# EAGLE design trashotron-driver (EAGLE 9.6.2)
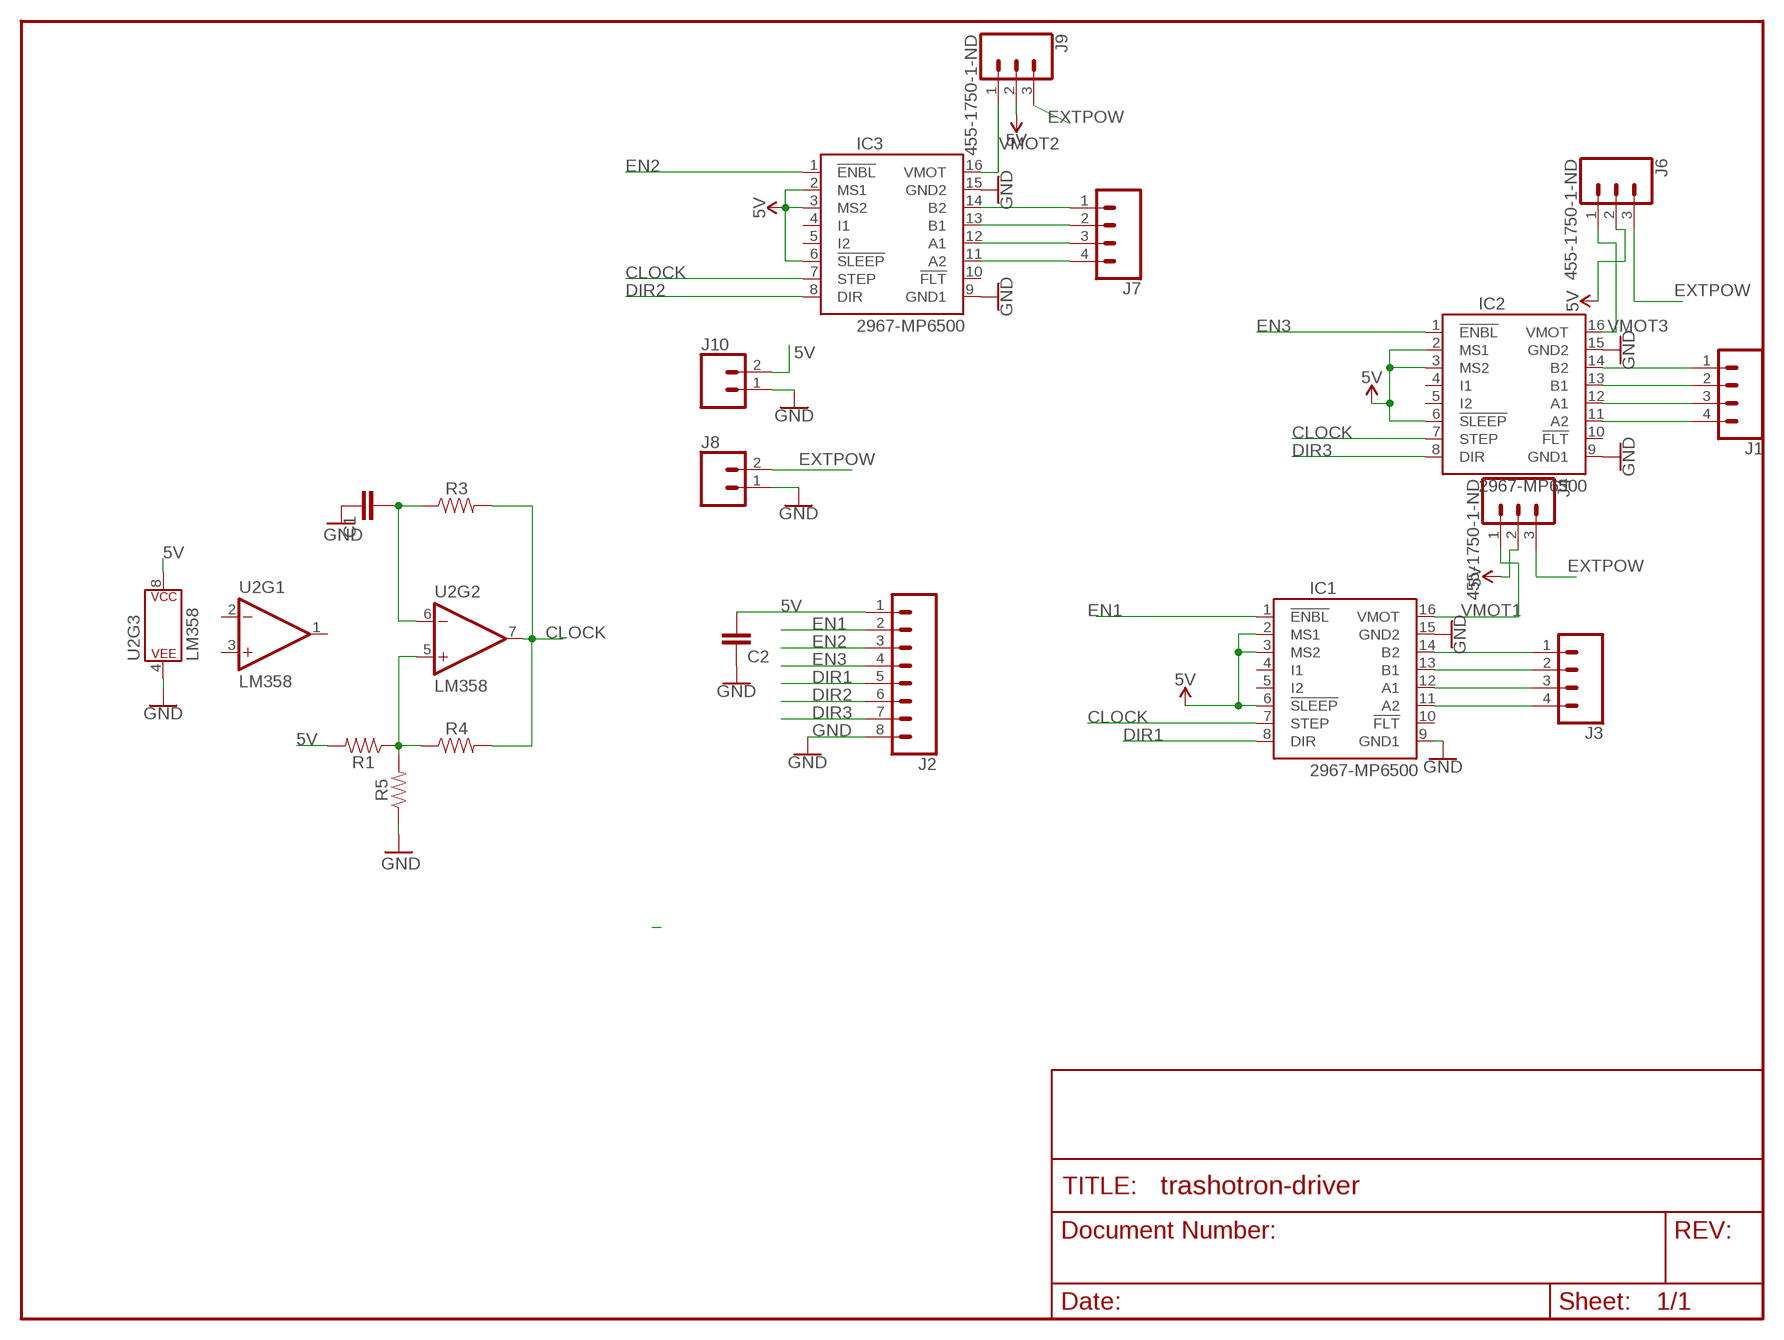
[diagram p0: schematic, sheet 1]

## Parts
C1  C-EU050-050X075  [C050-050X075]
C2  C-EU050-050X075  [C050-050X075]
IC1  2967-MP6500  [MP6500]
IC2  2967-MP6500  [MP6500]
IC3  2967-MP6500  [MP6500]
J1  CONN_04  [1X04]
J2  CONN_08"  [1X08]
J3  CONN_04  [1X04]
J4  455-1750-1-ND  CONN_03  [1X03]
J6  455-1750-1-ND  CONN_03  [1X03]
J7  CONN_04  [1X04]
J8  CONN_02  [1X02]
J9  455-1750-1-ND  CONN_03  [1X03]
J10  CONN_02  [1X02]
R1  RESISTORAXIAL-0.3  [AXIAL-0.3]
R3  RESISTORAXIAL-0.3  [AXIAL-0.3]
R4  RESISTORAXIAL-0.3  [AXIAL-0.3]
R5  RESISTORAXIAL-0.3  [AXIAL-0.3]
U2  LM358  [DIP08]

## Nets
5V: C2.2 IC1.2(MS1) IC1.3(MS2) IC1.6(!SLEEP) IC2.2(MS1) IC2.3(MS2) IC2.6(!SLEEP) IC3.2(MS1) IC3.3(MS2) IC3.6(!SLEEP) J2.1 J4.2 J6.2 J9.2 J10.2 R1.P$2 U2.8(P$V+)
CLOCK: IC1.7(STEP) IC2.7(STEP) IC3.7(STEP) R3.P$2 R4.P$2 U2.7(OUT)
DIR1: IC1.8(DIR) J2.5
DIR2: IC3.8(DIR) J2.6
DIR3: IC2.8(DIR) J2.7
EN1: IC1.1(!ENBL) J2.2
EN2: IC3.1(!ENBL) J2.3
EN3: IC2.1(!ENBL) J2.4
EXTPOW: J4.3 J6.3 J8.2 J9.3
GND [vcc]: C1.1 C2.1 IC1.9(GND1) IC1.15(GND2) IC2.9(GND1) IC2.15(GND2) IC3.9(GND1) IC3.15(GND2) J2.8 J8.1 J10.1 R5.P$1 U2.4(P$V-)
N$1: IC3.14(B2) J7.1
N$4: IC3.13(B1) J7.2
N$5: IC1.14(B2) J3.1
N$6: IC1.13(B1) J3.2
N$7: IC1.12(A1) J3.3
N$8: IC1.11(A2) J3.4
N$9: IC2.14(B2) J1.1
N$10: IC2.13(B1) J1.2
N$11: IC2.12(A1) J1.3
N$12: IC2.11(A2) J1.4
N$13: IC3.12(A1) J7.3
N$14: IC3.11(A2) J7.4
N$18: C1.2 R3.P$1 U2.6(-IN)
N$19: R1.P$1 R4.P$1 R5.P$2 U2.5(+IN)
VMOT1: IC1.16(VMOT) J4.1
VMOT2: IC3.16(VMOT) J9.1
VMOT3: IC2.16(VMOT) J6.1
Unconnected: IC1.4(I1) IC1.5(I2) IC1.10(!FLT) IC2.4(I1) IC2.5(I2) IC2.10(!FLT) IC3.4(I1) IC3.5(I2) IC3.10(!FLT) U2.1(OUT) U2.2(-IN) U2.3(+IN)

## Library data of the parts
C1 C2 = rcl:C-EU: CAPACITOR, European symbol; SPICEPREFIX: C
IC1-IC3 = pololu-stepper-driver:2967-MP6500: MP6500 Stepper Motor Driver Carrier; Potentiometer Current Control (Header Pins Soldered) #2967 MP6500 Stepper Motor Driver Carrier; Potentiometer Current Control (Header Pins Soldered) <https://www.pololu.com/product/2967> in Japan, Suzaku Lab. Ltd. <https://suzakugiken.jp/> #2967 MP6500ステッピングモータドライバボード ポテンショメータ式電流制御 (ヘッダーピン実装済み) <https://szc.jp/po2967>
J1 J3 J7 = SparkFun-Connectors:CONN_04: Multi connection point. Often used as Generic Header-pin footprint for 0.1 inch spaced/style header connections On any of the 0.1 inch spaced packages, you can populate with these: Break Away Headers - Straight <https://www.sparkfun.com/products/116> (PRT-00116) Break Away Male Headers - Right Angle <https://www.sparkfun.com/products/553> (PRT-00553) Female Headers <https://www.sparkfun.com/products/115> (PRT-00115) Break Away Headers - Machine Pin <https://www.sparkfun.com/products/117> (PRT-00117) Break Away Female Headers - Swiss Machine Pin <https://www.sparkfun.com/products/743> (PRT-00743) For SCREWTERMINALS and SPRING TERMINALS visit here: Screw Terimnals on SparkFun.com <https://www.sparkfun.com/search/results?term=Screw+Terminals> (5mm/3.5mm/2.54mm spacing) This device is also useful as a general connection point to wire up your design to another part of your project. Our various solder wires solder well into these plated through hole pads. Hook-Up Wire - Assortment (Stranded, 22 AWG) <https://www.sparkfun.com/products/11375> (PRT-11375) Hook-Up Wire - Assortment (Solid Core, 22 AWG) <https://www.sparkfun.com/products/11367> (PRT-11367) View the entire wire category on our website here <https://www.sparkfun.com/categories/141> Special notes: Molex polarized connector foot print use with SKU : PRT-08231 with associated crimp pins and housings. 1MM SMD Version SKU: PRT-10208; PROD_ID: CONN-09696
J2 = SparkFun-Connectors:CONN_08: Multi connection point. Often used as Generic Header-pin footprint for 0.1 inch spaced/style header connections On any of the 0.1 inch spaced packages, you can populate with these: Break Away Headers - Straight <https://www.sparkfun.com/products/116> (PRT-00116) Break Away Male Headers - Right Angle <https://www.sparkfun.com/products/553> (PRT-00553) Female Headers <https://www.sparkfun.com/products/115> (PRT-00115) Break Away Headers - Machine Pin <https://www.sparkfun.com/products/117> (PRT-00117) Break Away Female Headers - Swiss Machine Pin <https://www.sparkfun.com/products/743> (PRT-00743) Arduino Stackable Header - 8 Pin <https://www.sparkfun.com/products/9279> (PRT-09279) For SCREWTERMINALS and SPRING TERMINALS visit here: Screw Terimnals on SparkFun.com <https://www.sparkfun.com/search/results?term=Screw+Terminals> (5mm/3.5mm/2.54mm spacing) This device is also useful as a general connection point to wire up your design to another part of your project. Our various solder wires solder well into these plated through hole pads. Hook-Up Wire - Assortment (Stranded, 22 AWG) <https://www.sparkfun.com/products/11375> (PRT-11375) Hook-Up Wire - Assortment (Solid Core, 22 AWG) <https://www.sparkfun.com/products/11367> (PRT-11367) View the entire wire category on our website here <https://www.sparkfun.com/categories/141> Special notes: Molex polarized connector foot print use with SKU : PRT-08231 with associated crimp pins and housings. 1MM SMD Version SKU: PRT-10208 NOTES ON THE VARIANTS LOCK and LOCK_LONGPADS... This footprint was designed to help hold the alignment of a through-hole component (i.e. 6-pin header) while soldering it into place. You may notice that each hole has been shifted either up or down by 0.005 of an inch from it's more standard position (which is a perfectly straight line). This slight alteration caused the pins (the squares in the middle) to touch the edges of the holes. Because they are alternating, it causes a "brace" to hold the component in place. 0.005 has proven to be the perfect amount of "off-center" position when using our standard breakaway headers. Although looks a little odd when you look at the bare footprint, once you have a header in there, the alteration is very hard to notice. Also,if you push a header all the way into place, it is covered up entirely on the bottom side.; PROD_ID: CONN-08438
J4 J6 J9 = SparkFun-Connectors:CONN_03: Multi connection point. Often used as Generic Header-pin footprint for 0.1 inch spaced/style header connections On any of the 0.1 inch spaced packages, you can populate with these: Break Away Headers - Straight <https://www.sparkfun.com/products/116> (PRT-00116) Break Away Male Headers - Right Angle <https://www.sparkfun.com/products/553> (PRT-00553) Female Headers <https://www.sparkfun.com/products/115> (PRT-00115) Break Away Headers - Machine Pin <https://www.sparkfun.com/products/117> (PRT-00117) Break Away Female Headers - Swiss Machine Pin <https://www.sparkfun.com/products/743> (PRT-00743) Stackable Header - 3 Pin (Female, 0.1") <https://www.sparkfun.com/products/13875> (PRT-13875) For SCREWTERMINALS and SPRING TERMINALS visit here: Screw Terimnals on SparkFun.com <https://www.sparkfun.com/search/results?term=Screw+Terminals> (5mm/3.5mm/2.54mm spacing) This device is also useful as a general connection point to wire up your design to another part of your project. Our various solder wires solder well into these plated through hole pads. Hook-Up Wire - Assortment (Stranded, 22 AWG) <https://www.sparkfun.com/products/11375> (PRT-11375) Hook-Up Wire - Assortment (Solid Core, 22 AWG) <https://www.sparkfun.com/products/11367> (PRT-11367) View the entire wire category on our website here <https://www.sparkfun.com/categories/141> Special notes: Molex polarized connector foot print use with SKU : PRT-08232 with associated crimp pins and housings.; PROD_ID: XXX-00000
J8 J10 = SparkFun-Connectors:CONN_02: Multi connection point. Often used as Generic Header-pin footprint for 0.1 inch spaced/style header connections On any of the 0.1 inch spaced packages, you can populate with these: Break Away Headers - Straight <https://www.sparkfun.com/products/116> (PRT-00116) Break Away Male Headers - Right Angle <https://www.sparkfun.com/products/553> (PRT-00553) Female Headers <https://www.sparkfun.com/products/115> (PRT-00115) Break Away Headers - Machine Pin <https://www.sparkfun.com/products/117> (PRT-00117) Break Away Female Headers - Swiss Machine Pin <https://www.sparkfun.com/products/743> (PRT-00743) For SCREWTERMINALS and SPRING TERMINALS visit here: Screw Terimnals on SparkFun.com <https://www.sparkfun.com/search/results?term=Screw+Terminals> (5mm/3.5mm/2.54mm spacing) This device is also useful as a general connection point to wire up your design to another part of your project. Our various solder wires solder well into these plated through hole pads. Hook-Up Wire - Assortment (Stranded, 22 AWG) <https://www.sparkfun.com/products/11375> (PRT-11375) Hook-Up Wire - Assortment (Solid Core, 22 AWG) <https://www.sparkfun.com/products/11367> (PRT-11367) View the entire wire category on our website here <https://www.sparkfun.com/categories/141> Special notes: Molex polarized connector foot print use with: PRT-08233 with associated crimp pins and housings. 2.54_SCREWTERM for use with PRT-10571. 3.5mm Screw Terminal footprints for PRT-08084 5mm Screw Terminal footprints for use with PRT-08432
R1 R3-R5 = SparkFun-Resistors:RESISTOR: Generic Resistor Package
U2 = SparkFun-IC-Amplifiers:LM358: LM358 Jellybean op-amp Datasheet <http://www.sparkfun.com/datasheets/Components/General/LM358.pdf> SparkFun Products Op-Amp (Thru-Hole) - LM358 <https://www.sparkfun.com/products/9456> (COM-09456); PROD_ID: IC-09172

## Net classes
0 default: width 0.203 mm
1 vcc: width 0.178 mm

## Board
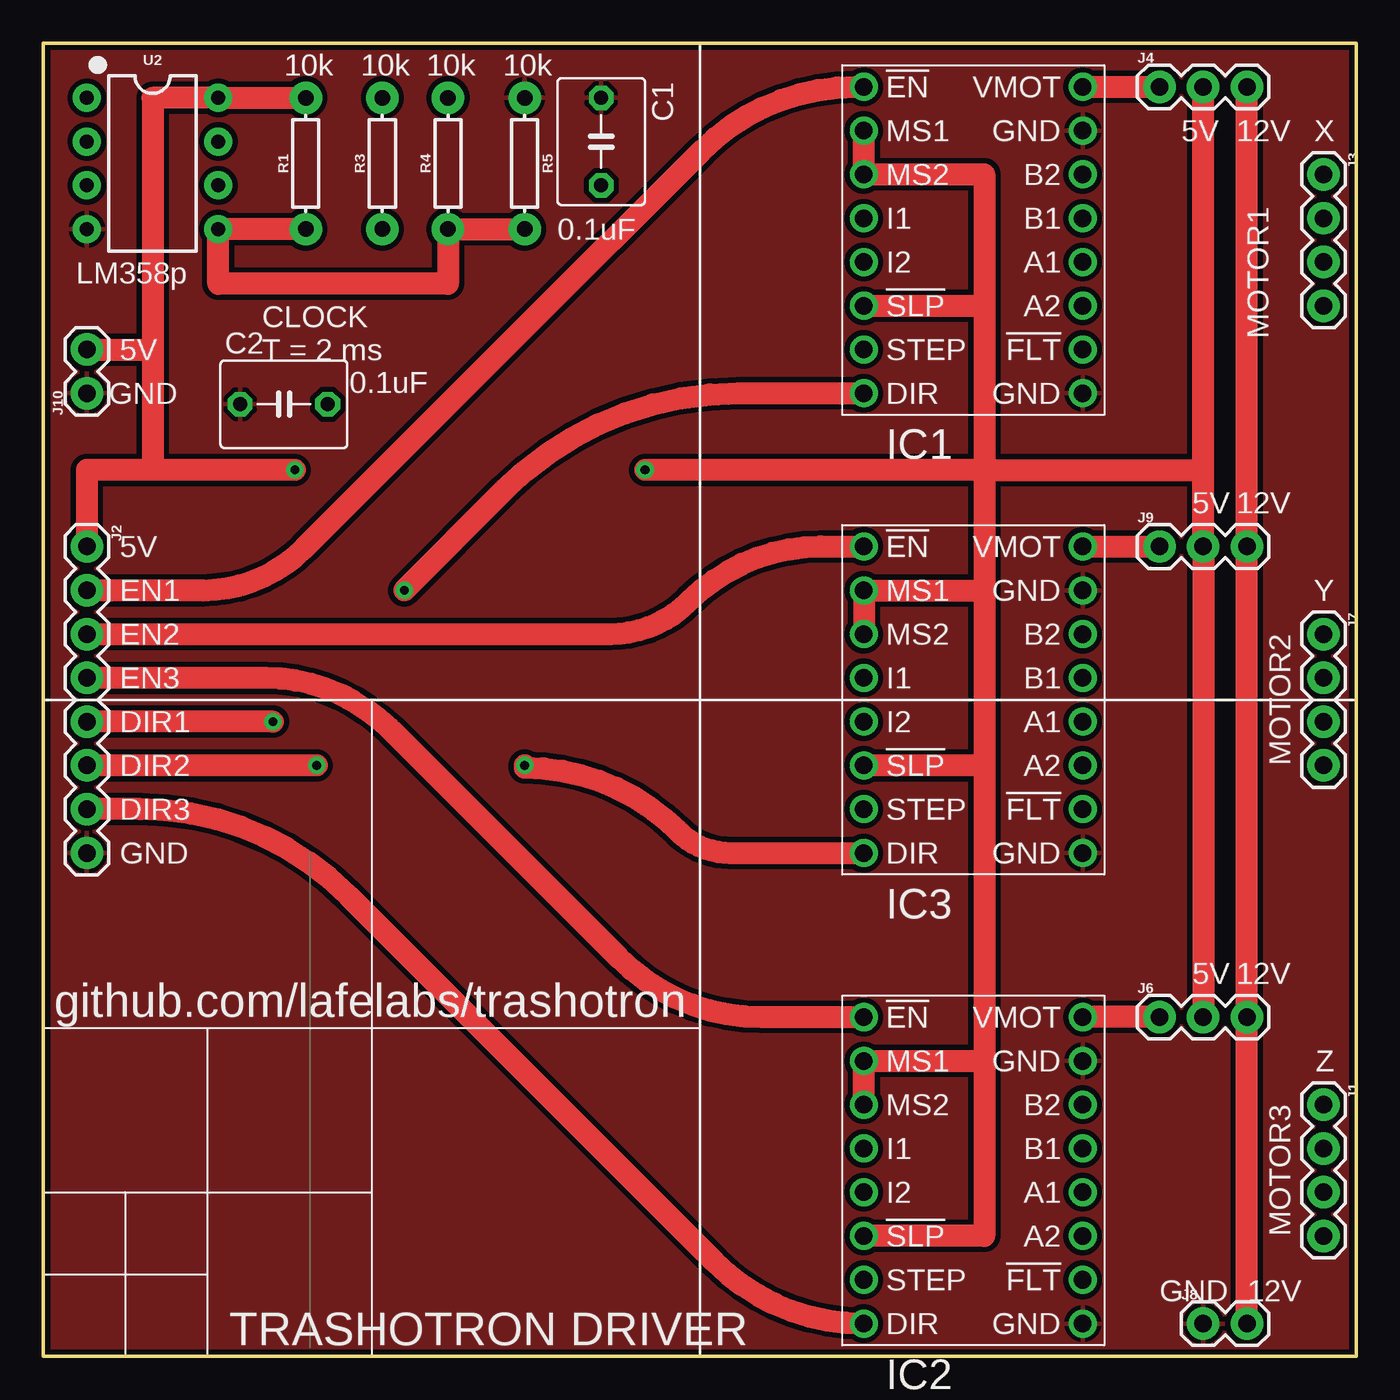
[diagram p1: board, top side]
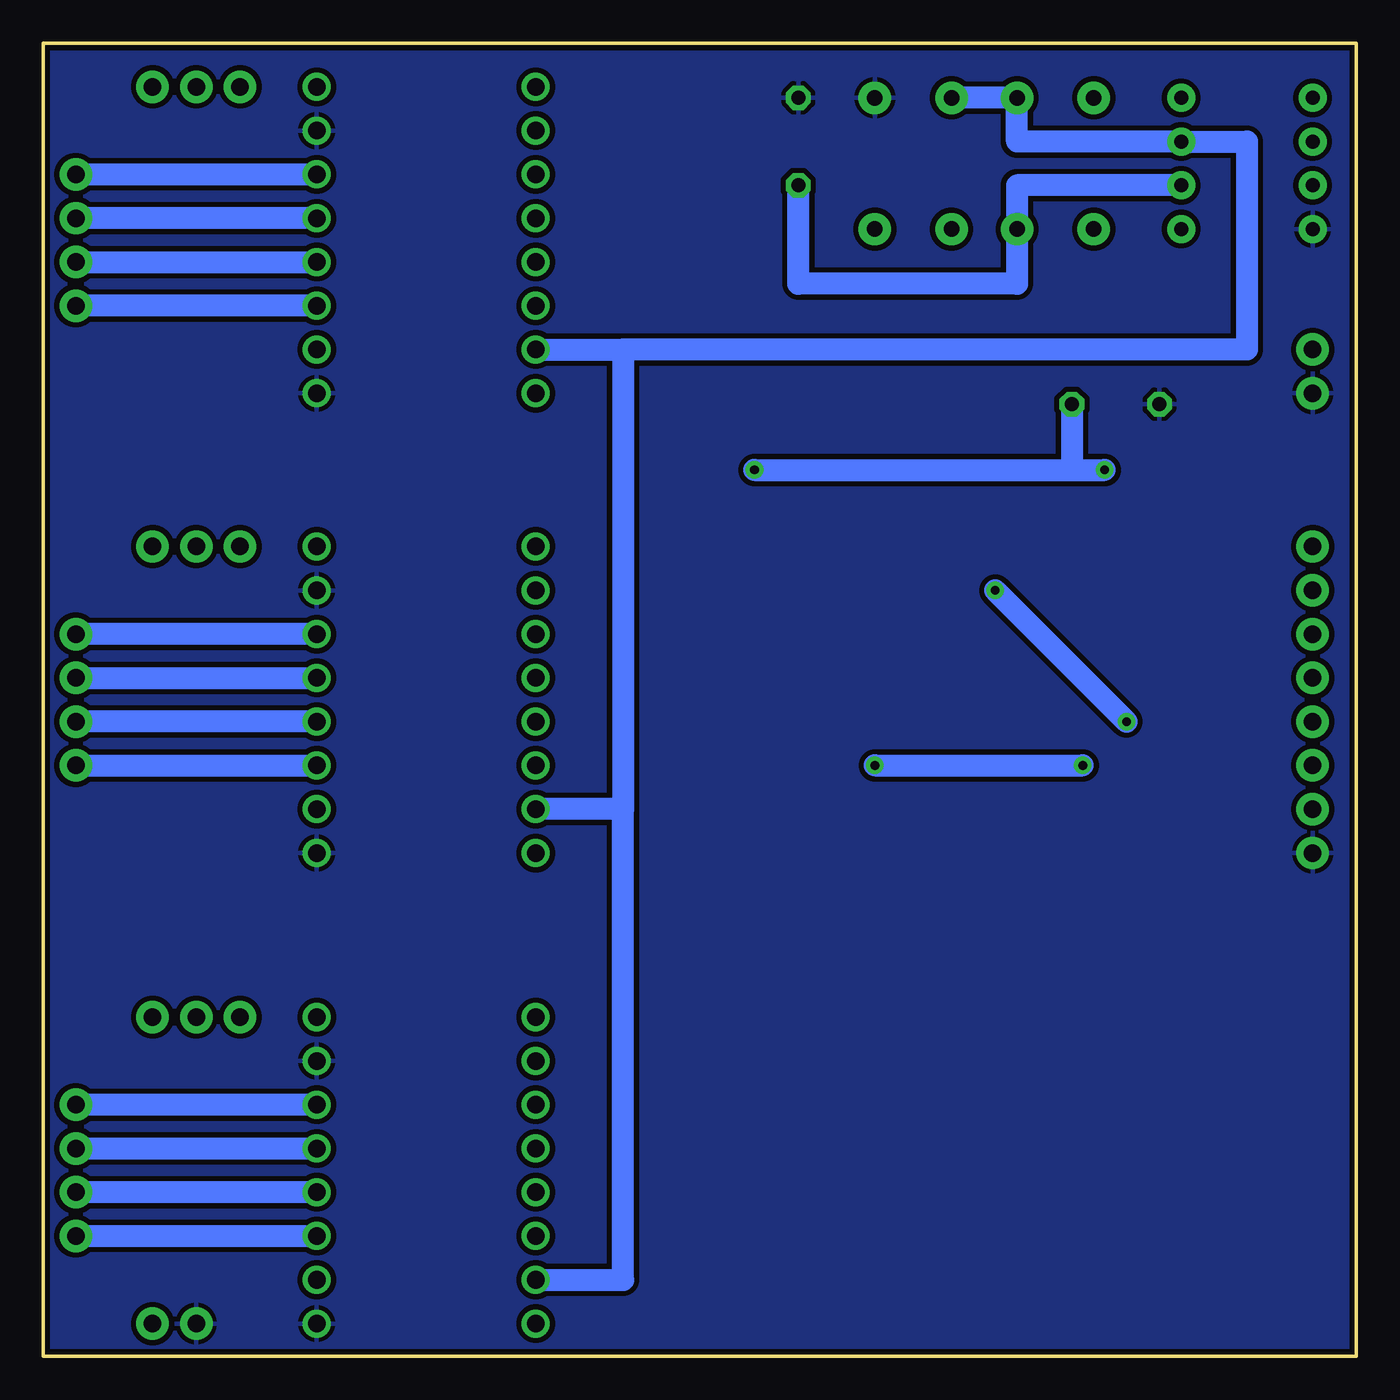
[diagram p2: board, bottom side, seen from below]

Size 76.2 x 76.2 mm. Coordinates in mm from the lower left corner, seen from the top.
Outline: 76.2,0 76.2,76.2 0,76.2 0,0 76.2,0
Copper layers (1*16): Top 0.035mm / dielectric 1.5mm / Bottom 0.035mm
Design rules "default": minimum track width 8mil, minimum drill 20mil, track to track 8mil, track to pad 8mil, pad to pad 8mil, via to via 8mil, smd to smd 8mil, copper to edge 10mil, drill to drill 8mil, minimum pad ring 12mil, minimum via ring 10mil, stop-mask expansion 4mil, vias tented up to drill 25mil, thermal gap 10mil

### Footprints (pad centres in the part's own frame; a part is rotated, then mirrored left to right if it is on the bottom)
C050-050X075 = drill 0.813 octagon: 1 -2.54,0; 2 2.54,0
MP6500 = drill 1.016: 1 -6.35,8.89; 2 -6.35,6.35; 3 -6.35,3.81; 4 -6.35,1.27; 5 -6.35,-1.27; 6 -6.35,-3.81; 7 -6.35,-6.35; 8 -6.35,-8.89; 9 6.35,-8.89; 10 6.35,-6.35; 11 6.35,-3.81; 12 6.35,-1.27; 13 6.35,1.27; 14 6.35,3.81; 15 6.35,6.35; 16 6.35,8.89
1X04 = drill 1.016 pad 1.88: 1 0,0; 2 2.54,0; 3 5.08,0; 4 7.62,0
1X08 = drill 1.016 pad 1.88: 1 0,0; 2 2.54,0; 3 5.08,0; 4 7.62,0; 5 10.16,0; 6 12.7,0; 7 15.24,0; 8 17.78,0
1X03 = drill 1.016 pad 1.88: 1 0,0; 2 2.54,0; 3 5.08,0
1X02 = drill 1.016 pad 1.88: 1 0,0; 2 2.54,0
AXIAL-0.3 = drill 0.9 pad 1.88: P$1 -3.81,0; P$2 3.81,0
DIP08 = drill 0.813 pad 1.626: 1 -3.81,-3.81; 2 -1.27,-3.81; 3 1.27,-3.81; 4 3.81,-3.81; 5 3.81,3.81; 6 1.27,3.81; 7 -1.27,3.81; 8 -3.81,3.81

### Placement (x,y rotation side)
C1  32.38,70.48 270 top
C2  13.97,55.24 0 top
IC1  53.98,64.77 0 top
IC2  53.98,10.79 0 top
IC3  53.98,38.1 0 top
J1  74.3,14.61 270 top
J2  2.54,46.99 270 top
J3  74.3,68.58 270 top
J4  64.77,73.66 0 top
J6  64.77,19.68 0 top
J7  74.3,41.91 270 top
J8  67.31,1.91 0 top
J9  64.77,46.99 0 top
J10  2.54,55.88 90 top
R1  15.24,69.22 90 top
R3  19.68,69.22 90 top
R4  23.5,69.22 90 top
R5  27.94,69.22 270 top
U2  6.35,69.22 270 top

### Tracks (layer width: path | path; a pad name or v marks a point on that pad's centre or on a via)
5V  (via drill 0.51)
  Top 1.27: 67.31,51.44 J4.2 | IC1.2 IC1.3 54.61,68.58 54.61,60.96 | IC1.6 54.61,60.96 | 54.61,60.96 54.61,51.44 | 54.61,51.44 54.61,44.45 | 54.61,44.45 IC3.2 IC3.3 | 54.61,51.44 67.31,51.44 | 54.61,44.45 54.61,34.29 | 54.61,34.29 IC3.6 | 54.61,34.29 54.61,17.14 | 54.61,17.14 54.61,6.99 IC2.6 | IC2.3 IC2.2 54.61,17.14 | 67.31,51.44 J9.2 J6.2 | v14.61,51.44 6.35,51.44 | 6.35,51.44 2.54,51.44 J2.1 | 54.61,51.44 v34.92,51.44 | 6.35,58.42 6.35,73.03 U2.8 R1.P$2 | 6.35,58.42 6.35,51.44 | J10.2 6.35,58.42
  Bottom 1.27: v34.92,51.44 16.51,51.44 | 16.51,51.44 v14.61,51.44 | C2.2 16.51,51.44
CLOCK
  Bottom 1.27: IC2.7 42.55,4.45 42.55,31.75 | 42.55,31.75 IC3.7 | IC1.7 42.55,58.42 | 42.55,58.42 42.55,31.75 | R4.P$2 R3.P$2 19.68,70.48 U2.7 6.35,70.48 6.35,58.42 42.55,58.42
DIR1  (via drill 0.51)
  Top 1.27: v20.95,44.45 26.76,50.26 arc-45 40.34,55.88 IC1.8 | v13.34,36.83 J2.5
  Bottom 1.27: v20.95,44.45 v13.34,36.83
DIR2  (via drill 0.51)
  Top 1.27: v27.94,34.29 27.94,34.16 arc-45 36.83,30.48 arc45 39.9,29.21 IC3.8 | v15.88,34.29 J2.6
  Bottom 1.27: v27.94,34.29 v15.88,34.29
DIR3
  Top 1.27: IC2.8 arc-45 38.95,5.5 17.69,26.76 arc45 5.64,31.75 J2.7
EN1
  Top 1.27: J2.2 9.24,44.45 arc45 15.15,46.9 27.62,59.37 38.19,69.94 arc-45 47.17,73.66 IC1.1
EN2
  Top 1.27: IC3.1 45.13,46.99 arc45 37.47,43.81 arc-45 32.87,41.91 J2.3
EN3
  Top 1.27: IC2.1 41.72,19.68 arc-45 33.37,23.14 20.15,36.36 arc45 12.89,39.37 J2.4
EXTPOW
  Top 1.27: J8.2 J6.3 J9.3 J4.3
GND
  pour Top (isolate 0.305): 76.2,0 0,0 0,76.2 76.2,76.2
  pour Bottom (isolate 0.305): 76.2,0 0,0 0,76.2 76.2,76.2
N$1
  Bottom 1.27: IC3.14 J7.1
N$4
  Bottom 1.27: J7.2 IC3.13
N$5
  Bottom 1.27: J3.1 IC1.14
N$6
  Bottom 1.27: IC1.13 J3.2
N$7
  Bottom 1.27: J3.3 IC1.12
N$8
  Bottom 1.27: IC1.11 J3.4
N$9
  Bottom 1.27: IC2.14 J1.1
N$10
  Bottom 1.27: J1.2 IC2.13
N$11
  Bottom 1.27: IC2.12 J1.3
N$12
  Bottom 1.27: J1.4 IC2.11
N$13
  Bottom 1.27: IC3.12 J7.3
N$14
  Bottom 1.27: J7.4 IC3.11
N$18
  Bottom 1.27: U2.6 19.68,67.94 R3.P$1 19.68,62.23 32.38,62.23 C1.2
N$19
  Top 1.27: R5.P$2 R4.P$1 23.5,62.23 10.16,62.23 U2.5 R1.P$1
VMOT1
  Top 1.27: IC1.16 J4.1
VMOT2
  Top 1.27: IC3.16 J9.1
VMOT3
  Top 1.27: J6.1 IC2.16

### Text on the board
tPlace: 10k | 10k | 10k | 10k | X | 5V | 12V | 0.1uF | LM358p | MOTOR1 | 5V | CLOCK / T = 2 ms | 0.1uF | GND | 5V | 12V | 5V | Y | EN1 | EN2 | EN3 | DIR1 | DIR2 | MOTOR2 | DIR3 | GND | 5V | 12V | github.com/lafelabs/trashotron | Z | MOTOR3 | GND | 12V | TRASHOTRON DRIVER
tValues: Tent Vias! | Arduino Wee v1.3